# Altium schematic sheet Motor_Driver_V1.0.SchDoc
size A4
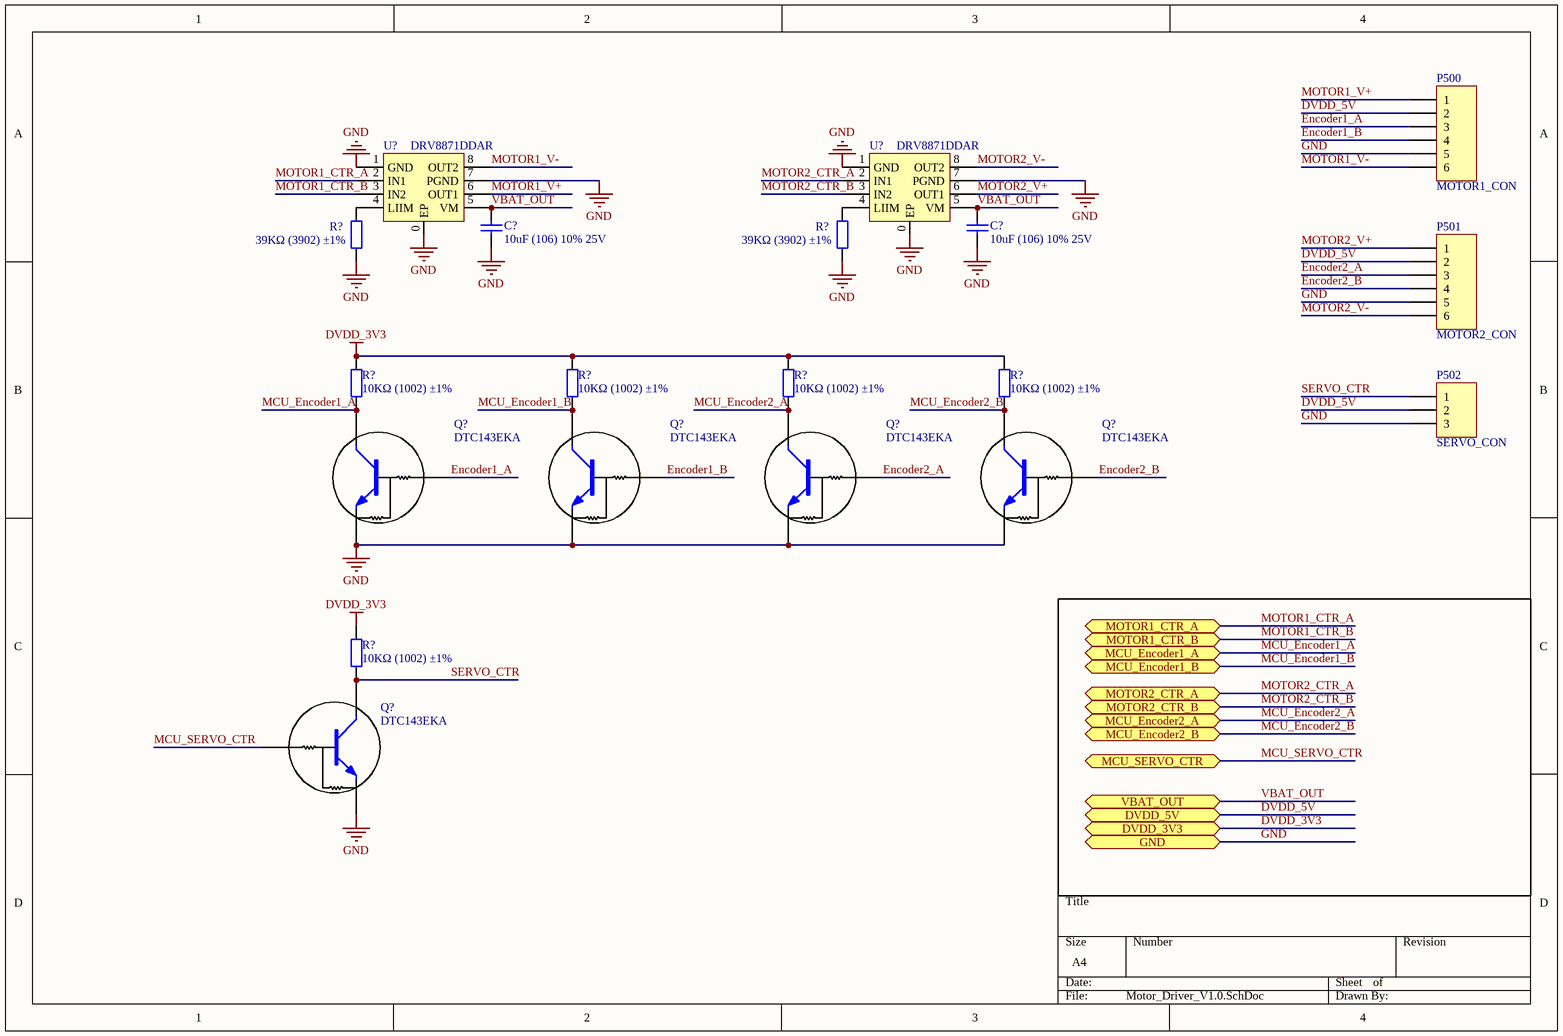
[diagram p0: Motor_Driver_V1.0.SchDoc]

## Parts
(Parts that share a designator on the sheet are numbered #1, #2 ... from top to bottom, then left to right.)
C?#1  10uF (106) 10% 25V  [0805_C]
C?#2  10uF (106) 10% 25V  [0805_C]
P500  MOTOR1_CON  [HDR1X6]
P501  MOTOR2_CON  [HDR1X6]
P502  SERVO_CON  [HDR1X3]
Q?#1  DTC143EKA  [SOT-23-3]
Q?#2  DTC143EKA  [SOT-23-3]
Q?#3  DTC143EKA  [SOT-23-3]
Q?#4  DTC143EKA  [SOT-23-3]
Q?#5  DTC143EKA  [SOT-23-3]
R?#1  39KΩ (3902) ±1%  [0402_R]
R?#2  39KΩ (3902) ±1%  [0402_R]
R?#3  10KΩ (1002) ±1%  [0603_R]
R?#4  10KΩ (1002) ±1%  [0603_R]
R?#5  10KΩ (1002) ±1%  [0603_R]
R?#6  10KΩ (1002) ±1%  [0603_R]
R?#7  10KΩ (1002) ±1%  [0603_R]
U?#1  DRV8871DDAR  [SOP-8_150mil DCDC]
U?#2  DRV8871DDAR  [SOP-8_150mil DCDC]

## Ports
DVDD_3V3, DVDD_5V, GND, MCU_Encoder1_A, MCU_Encoder1_B, MCU_Encoder2_A, MCU_Encoder2_B, MCU_SERVO_CTR, MOTOR1_CTR_A, MOTOR1_CTR_B, MOTOR2_CTR_A, MOTOR2_CTR_B, VBAT_OUT

## Nets
DVDD_3V3: R?#3.2 R?#4.2 R?#5.2 R?#6.2 R?#7.2 ; port DVDD_3V3
GND: C?#1.1 C?#2.1 P500.5 P501.5 P502.3 Q?#1.2(E) Q?#2.2(E) Q?#3.2(E) Q?#4.2(E) Q?#5.2(E) R?#1.1 R?#2.1 U?#1.0(EP) U?#1.1(GND) U?#1.7(PGND) U?#2.0(EP) U?#2.1(GND) U?#2.7(PGND) ; port GND
DVDD_5V: P500.2 P501.2 P502.2 ; port DVDD_5V
Encoder1_A: P500.3 Q?#1.1(B)
Encoder1_B: P500.4 Q?#2.1(B)
Encoder2_A: P501.3 Q?#3.1(B)
Encoder2_B: P501.4 Q?#4.1(B)
MCU_Encoder1_A: Q?#1.3(C) R?#3.1 ; port MCU_Encoder1_A
MCU_Encoder1_B: Q?#2.3(C) R?#4.1 ; port MCU_Encoder1_B
MCU_Encoder2_A: Q?#3.3(C) R?#5.1 ; port MCU_Encoder2_A
MCU_Encoder2_B: Q?#4.3(C) R?#6.1 ; port MCU_Encoder2_B
MCU_SERVO_CTR: Q?#5.1(B) ; port MCU_SERVO_CTR
MOTOR1_CTR_A: U?#1.2(IN1) ; port MOTOR1_CTR_A
MOTOR1_CTR_B: U?#1.3(IN2) ; port MOTOR1_CTR_B
MOTOR1_V+: P500.1 U?#1.6(OUT1)
MOTOR1_V-: P500.6 U?#1.8(OUT2)
MOTOR2_CTR_A: U?#2.2(IN1) ; port MOTOR2_CTR_A
MOTOR2_CTR_B: U?#2.3(IN2) ; port MOTOR2_CTR_B
MOTOR2_V+: P501.1 U?#2.6(OUT1)
MOTOR2_V-: P501.6 U?#2.8(OUT2)
SERVO_CTR: P502.1 Q?#5.3(C) R?#7.1
VBAT_OUT: C?#1.2 C?#2.2 U?#1.5(VM) U?#2.5(VM) ; port VBAT_OUT
NetR?#1_2: R?#1.2 U?#1.4(LIIM)
NetR?#2_2: R?#2.2 U?#2.4(LIIM)

## Library data of the parts
C?#1 C?#2 = 0805 10uF (106) 10% 25V: 贴片电容; ComponentLink1Description: 供应商链接; ComponentLink1URL: http://www.szlcsc.com/product/details_16532.html; Package: 0805; Supplier: LC; SuppliersPartNumber: C15850
P500 P501 = Header 6: Header, 6-Pin; LatestRevisionDate: 17-Jul-2002; LatestRevisionNote: Re-released for DXP Platform.; Publisher: Altium Limited
P502 = Header 3: Header, 3-Pin; LatestRevisionDate: 17-Jul-2002; LatestRevisionNote: Re-released for DXP Platform.; Publisher: Altium Limited
Q?#1-Q?#5 = SOT-23 DTC143EKA: 三极管
R?#1 R?#2 = 0402 39KΩ (3902) 1%: 贴片电阻; ComponentLink1Description: 供应商链接; ComponentLink1URL: http://www.szlcsc.com/product/details_26526.html; Package: 0402; Supplier: LC; SuppliersPartNumber: C25783
R?#3-R?#7 = 0603 10KΩ (1002) 1%: 贴片电阻; ComponentLink1Description: 供应商链接; ComponentLink1URL: http://www.szlcsc.com/product/details_26547.html; Package: 0603; Supplier: LC; SuppliersPartNumber: C25804
U?#1 U?#2 = DRV8871DDAR: MOTOR DRV IC